# EAGLE design ECPR_EMITTER (EAGLE 9.4.2)
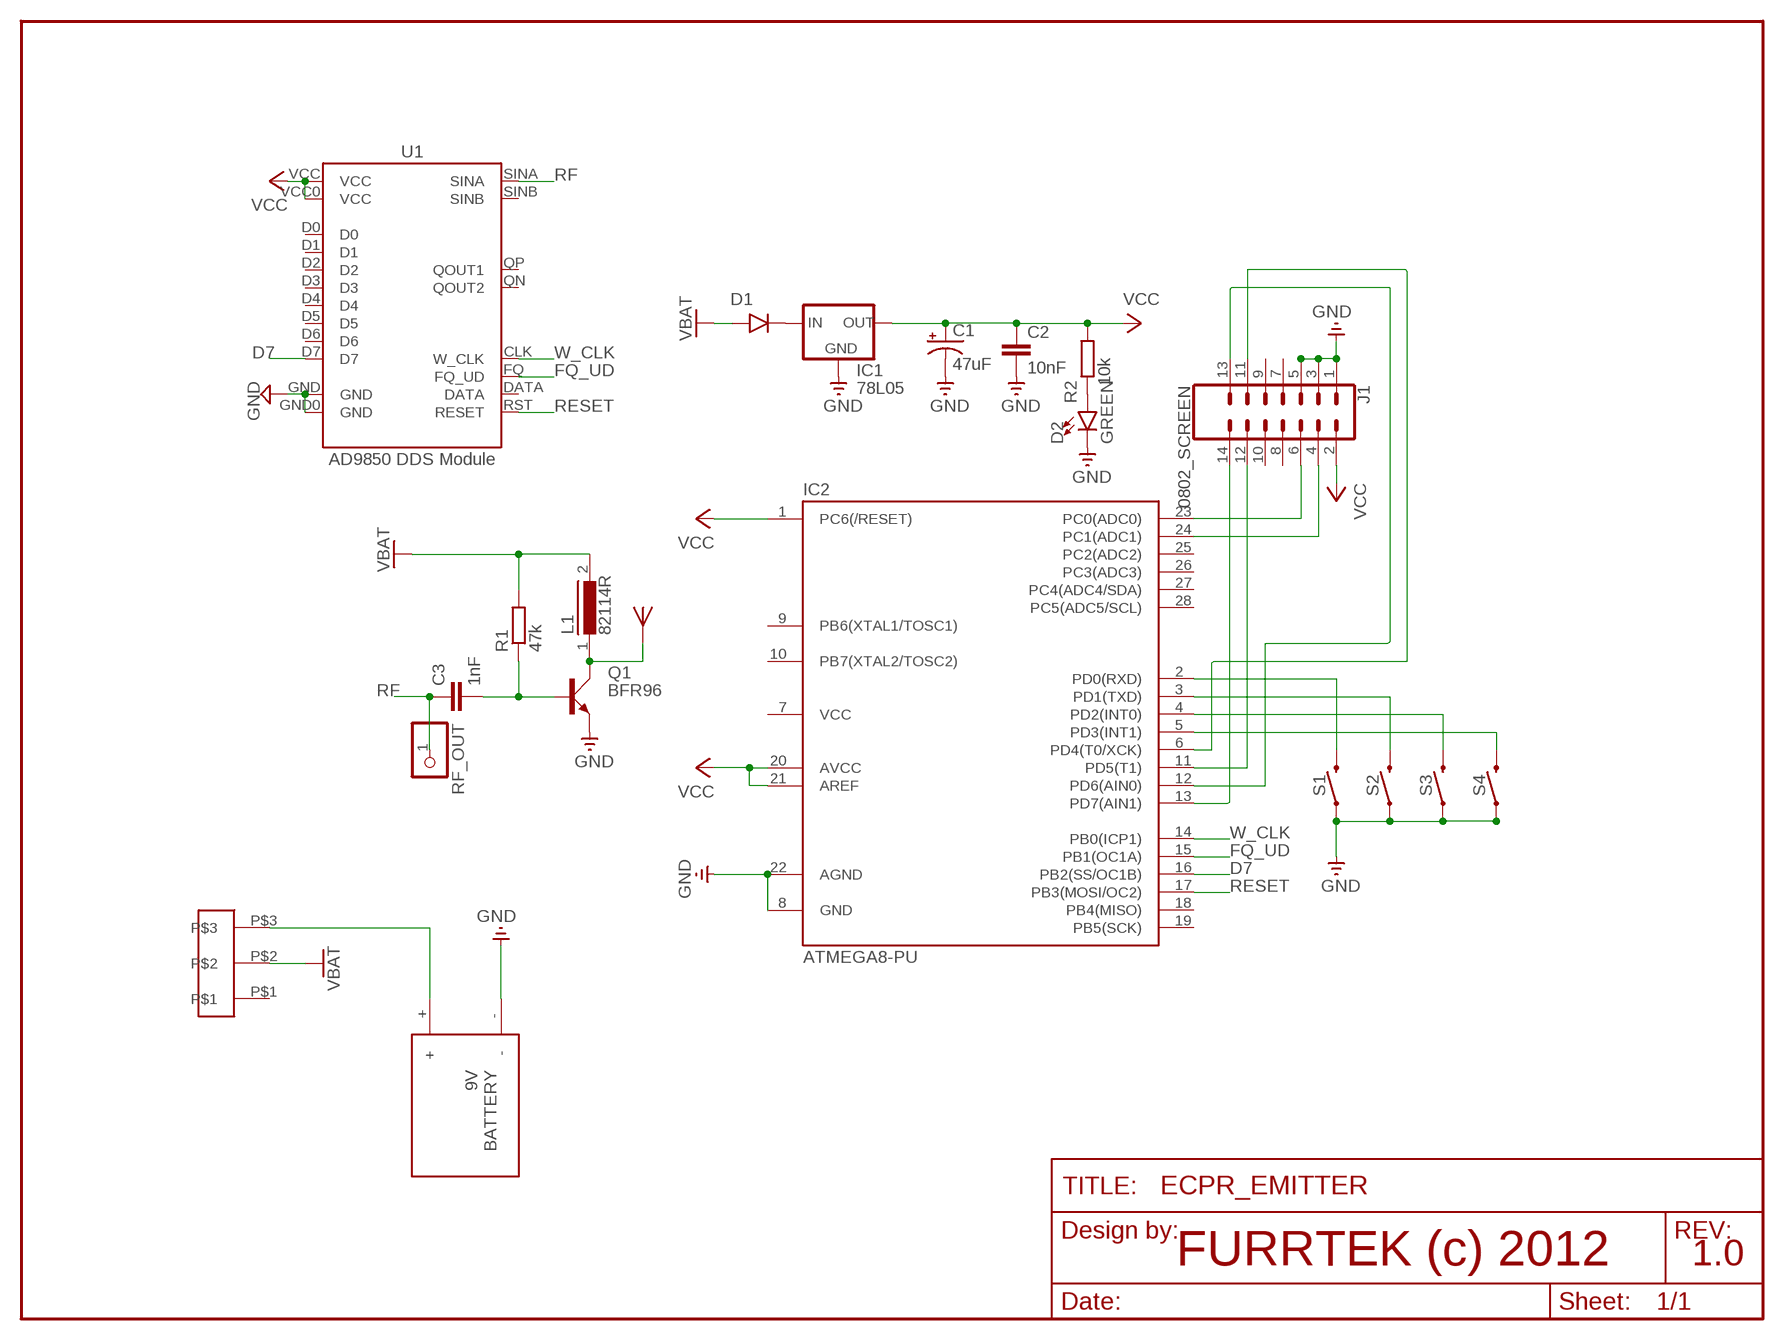
[diagram p0: schematic, sheet 1]

## Parts
C1  47uF  CAP_POLPTH2  [CPOL-RADIAL-10UF-25V]
C2  10nF  10NF-PTH-10MM-10000V-1-%  [CAP-PTH-10MM]
C3  1nF  C5/3  [C5B3]
D1  1N4001  [DO41-10]
D2  GREEN  LED-3MM-NO_SILK  [LED_3MM-NS]
FRAME1  FRAME-LETTERNO_PACKAGE  [DUMMY]
IC1  78L05  V_REG_78XXSIDE  [78XXL]
IC2  ATMEGA8-PU  [DIL28-3]
J1  0802_SCREEN  CONN_08X2  [2X8]
L1  82114R  [82114R]
Q1  BFR96  [SOT37]
R1  47k  R-EU_0207/7  [0207/7]
R2  10k  R-EU_0207/7  [0207/7]
RF_OUT  PINHD-1X1  [1X01]
S1  MOMENTARY-SWITCH-SPST-PTH-12MM  [TACTILE_SWITCH_PTH_12MM]
S2  MOMENTARY-SWITCH-SPST-PTH-12MM  [TACTILE_SWITCH_PTH_12MM]
S3  MOMENTARY-SWITCH-SPST-PTH-12MM  [TACTILE_SWITCH_PTH_12MM]
S4  MOMENTARY-SWITCH-SPST-PTH-12MM  [TACTILE_SWITCH_PTH_12MM]
U1  AD9850 DDS Module  DDS_MODULE:AD9850DDS_MODULE  [DDS_AD9850]
U$1  ANT.  ANTENNA  [ANTENNA]
U$2  PACKAGESWITCH  [SLIDESWITCH]
U$3  BAT  [BAT]

## Nets
D7: IC2.16(PB2(SS/OC1B)) U1.D7
FQ_UD: IC2.15(PB1(OC1A)) U1.FQ(FQ_UD)
GND: C1.2(-) C2.2 D2.K(C) IC1.GND IC2.8(GND) IC2.22(AGND) J1.1 J1.3 J1.5 Q1.2(E) S1.1 S2.1 S3.1 S4.1 U1.GND U1.GND0(GND) U$3.-
N$1: D1.C(CATHODE) IC1.IN
N$2: C3.2 Q1.3(B) R1.1
N$3: IC2.2(PD0(RXD)) S1.3
N$4: IC2.3(PD1(TXD)) S2.3
N$5: IC2.4(PD2(INT0)) S3.3
N$6: IC2.5(PD3(INT1)) S4.3
N$7: L1.1 Q1.1(C) U$1.ANT
N$8: IC2.24(PC1(ADC1)) J1.4
N$9: IC2.23(PC0(ADC0)) J1.6
N$10: IC2.13(PD7(AIN1)) J1.14
N$11: IC2.11(PD5(T1)) J1.12
N$12: U$2.P$3 U$3.+
N$13: IC2.12(PD6(AIN0)) J1.13
N$14: IC2.6(PD4(T0/XCK)) J1.11
N$16: D2.A R2.1
RESET: IC2.17(PB3(MOSI/OC2)) U1.RST(RESET)
RF: C3.1 RF_OUT.1 U1.SINA
VBAT: D1.A(ANODE) L1.2 R1.2 U$2.P$2
VCC: C1.1(+) C2.1 IC1.OUT IC2.1(PC6(/RESET)) IC2.20(AVCC) IC2.21(AREF) J1.2 R2.2 U1.VCC U1.VCC0(VCC)
W_CLK: IC2.14(PB0(ICP1)) U1.CLK(W_CLK)
Unconnected: IC2.9(PB6(XTAL1/TOSC1)) IC2.10(PB7(XTAL2/TOSC2)) IC2.18(PB4(MISO)) IC2.19(PB5(SCK)) IC2.25(PC2(ADC2)) IC2.26(PC3(ADC3)) IC2.27(PC4(ADC4/SDA)) IC2.28(PC5(ADC5/SCL)) J1.7 J1.8 J1.9 J1.10 U1.D0 U1.D1 U1.D2 U1.D3 U1.D4 U1.D5 U1.D6 U1.DATA U1.QN(QOUT2) U1.QP(QOUT1) U1.SINB U$2.P$1

## Notes on the sheet
- FURRTEK (c) 2012 | 1.0

## Power pins joined to a net without a drawn wire
VCC: IC2.7(VCC)

## Library data of the parts
C1 = SparkFun:CAP_POL: Capacitor Polarized These are standard SMD and PTH capacitors. Normally 10uF, 47uF, and 100uF in electrolytic and tantalum varieties. Always verify the external diameter of the through hole cap, it varies with capacity, voltage, and manufacturer. The EIA devices should be standard.
C2 = SparkFun-Capacitors:10NF: 0.01uF/10nF/10,000pF ceramic capacitors A capacitor is a passive two-terminal electrical component used to store electrical energy temporarily in an electric field. CAP-09321; PROD_ID: CAP-09321
C3 = capacitor-wima:C: CAPACITOR naming: grid - package width
D1 = tango:1N4001: DIODE general purpose rectifier, 1 A
D2 = SparkFun-LED:LED: LED (Generic) Standard schematic elements and footprints for 5mm, 3mm, 1206, and 0603 sized LEDs. Generic LEDs with no color specified.
FRAME1 = SparkFun-Aesthetics:FRAME-LETTER: Schematic Frame - Letter Standard 8.5x11 US Letter frame; DESIGNER: Nobody; VERSION: v01
IC1 = SparkFun:V_REG_78XX: Voltage Regulator Standard 7805 5V regulator. IGO (Input Ground Output). Spark Fun Electronics SKU : COM-00107
IC2 = atmega8:ATMEGA8-PU
J1 = SparkFun-Connectors:CONN_08X2: Multi connection point. Often used as Generic Header-pin footprint for 0.1 inch spaced/style header connections You can populate with any combo of single row headers, but if you'd like an exact match, check this: Header - 2x8 (Male, 0.1") <https://www.sparkfun.com/products/13156> (PRT-13156) On any of the 0.1 inch spaced packages, you can populate with these: Break Away Headers - Straight <https://www.sparkfun.com/products/116> (PRT-00116) Break Away Male Headers - Right Angle <https://www.sparkfun.com/products/553> (PRT-00553) Female Headers <https://www.sparkfun.com/products/115> (PRT-00115) Break Away Headers - Machine Pin <https://www.sparkfun.com/products/117> (PRT-00117) Break Away Female Headers - Swiss Machine Pin <https://www.sparkfun.com/products/743> (PRT-00743)
L1 = inductors:82114R: INDUCTOR
Q1 = transistor-small-signal:BFR96: NPN Silicon High-Frequency Transistor Source: http://www.ee.siue.edu/~alozows/library/datasheets/BFR96.pdf
R1 R2 = resistor:R-EU_: RESISTOR, European symbol
RF_OUT = adafruit:PINHD-1X1: Pin header 1x1 for 0.1" spacing With round pins
S1-S4 = SparkFun-Switches:MOMENTARY-SWITCH-SPST: Momentary Switch (Pushbutton) - SPST Normally-open (NO) SPST momentary switches (buttons, pushbuttons). Variants PTH-12MM - 12mm square, through-hole Momentary Pushbutton Switch - 12mm Square <https://www.sparkfun.com/products/9190> (COM-09190) PTH-6.0MM, PTH-6.0MM-KIT - 6.0mm square, through-hole Mini Pushbutton Switch <https://www.sparkfun.com/products/97> (COM-00097) KIT package intended for soldering kit's - only one side of pads' copper is exposed. PTH-RIGHT-ANGLE-KIT - Right-angle, through-hole Right Angle Tactile Button <https://www.sparkfun.com/products/10791> - Used on SparkFun BigTime Watch Kit <https://www.sparkfun.com/products/11734> SMD-12MM - 12mm square, surface-mount Tactile Button - SMD (12mm) <https://www.sparkfun.com/products/12993> (COM-12993) Used on SparkFun PicoBoard <https://www.sparkfun.com/products/11888> SMD-4.5MM - 4.5mm Square Trackball Switch Used on SparkFun Blackberry Trackballer Breakout <https://www.sparkfun.com/products/13169> SMD-4.6MMX2.8MM - 4.60mm x 2.80mm, surface mount Used on SparkFun SAMD21 Mini Breakout <https://www.sparkfun.com/products/13664> SMD-5.2MM, SMD-5.2-REDUNDANT - 5.2mm square, surface-mount Mini Pushbutton Switch - SMD <https://www.sparkfun.com/products/8720> (COM-08720) Used on Arduino Pro Mini <https://www.sparkfun.com/products/11114> REDUNDANT package connects both switch circuits together SMD-6.0X3.5MM - 6.0 x 3.5mm, surface mount Momentary Reset Switch SMD <https://www.sparkfun.com/products/8229> (COM-08229) SMD-6.2MM-TALL - 6.2mm square, surface mount Tactile Button - SMD (6mm) <https://www.sparkfun.com/products/12992> Used on SparkFun Digital Sandbox <https://www.sparkfun.com/products/12651> SMD-RIGHT-ANGLE - Right-angle, surface mount Used on SparkFun Block for Intel® Edison - Arduino <https://www.sparkfun.com/products/13036>; PROD_ID: SWCH-09185; SF_SKU: COM-09190
U1 = dds-module-ad9850:DDS_MODULE:AD9850: AD9850 DDS Module Created by Johan Adler, October 2014. Not tested on an actual PCB, so I can't promise anything. Also please check the actual pinout of your specific module. Mine are of the low price eBay version, and the pinout is correct for my modules. The placement of VCC over data pins over GND on the symbol is meant to make it easier to set it up for default serial transfer. For this you would connect D0 and D1 to VCC, D2 to GND. IOUT is analog signal out, sinus wave, QOUT is square wave. Outputs 1 are normal, outputs 2 are inverted.
U$1 = computronics.com.au:ANTENNA: Antenna - single wire
U$2 = SLIDESWITCH:PACKAGESWITCH
U$3 = BATTERY:BAT: 2000mAh battery

## Board
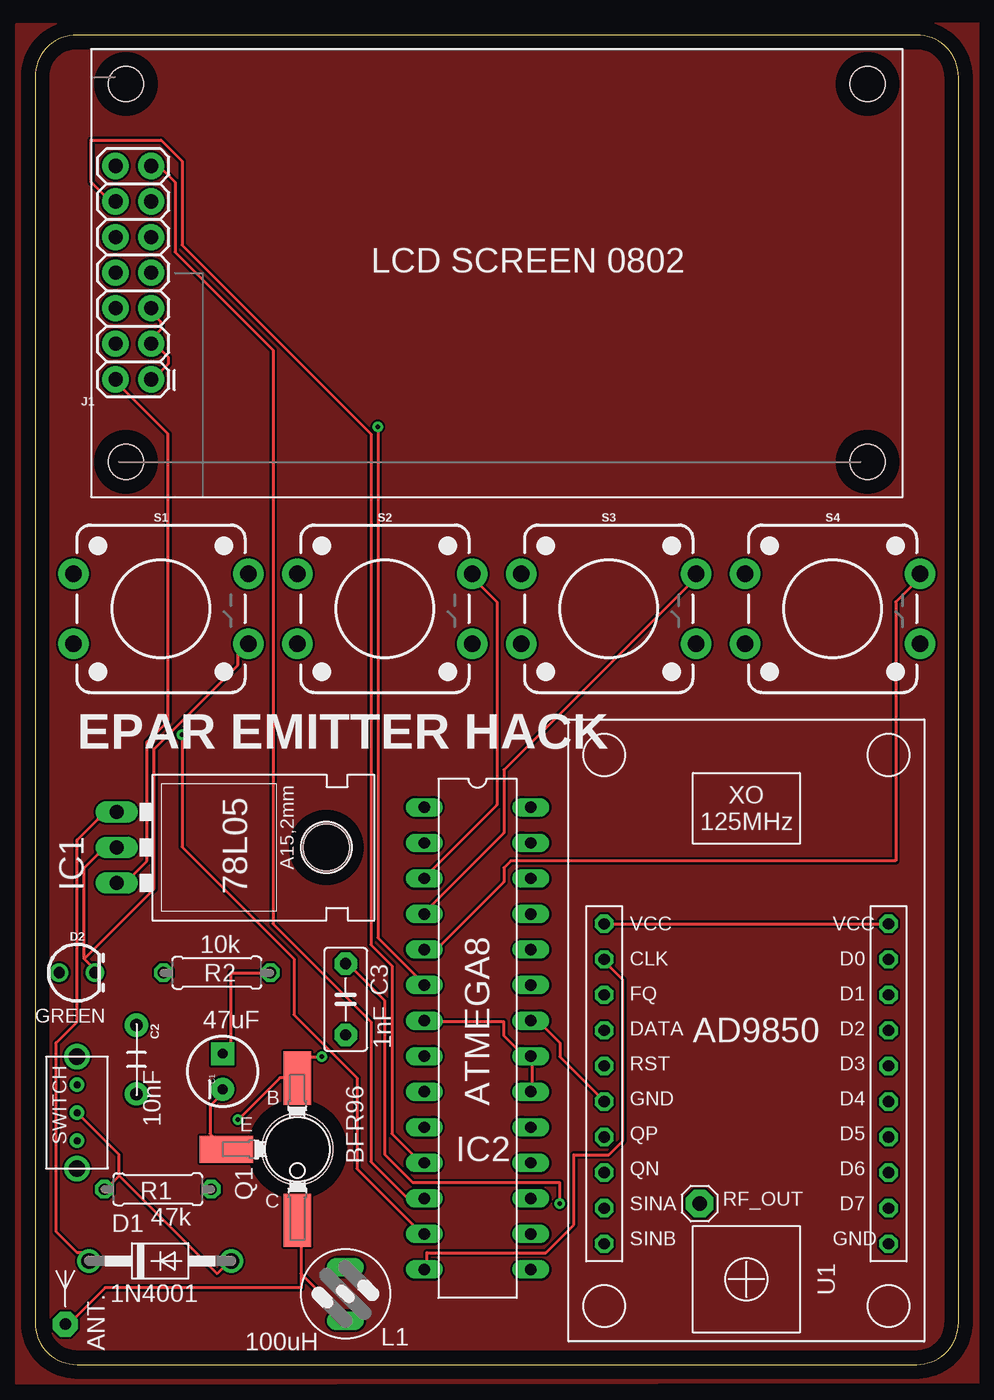
[diagram p1: board, top side]
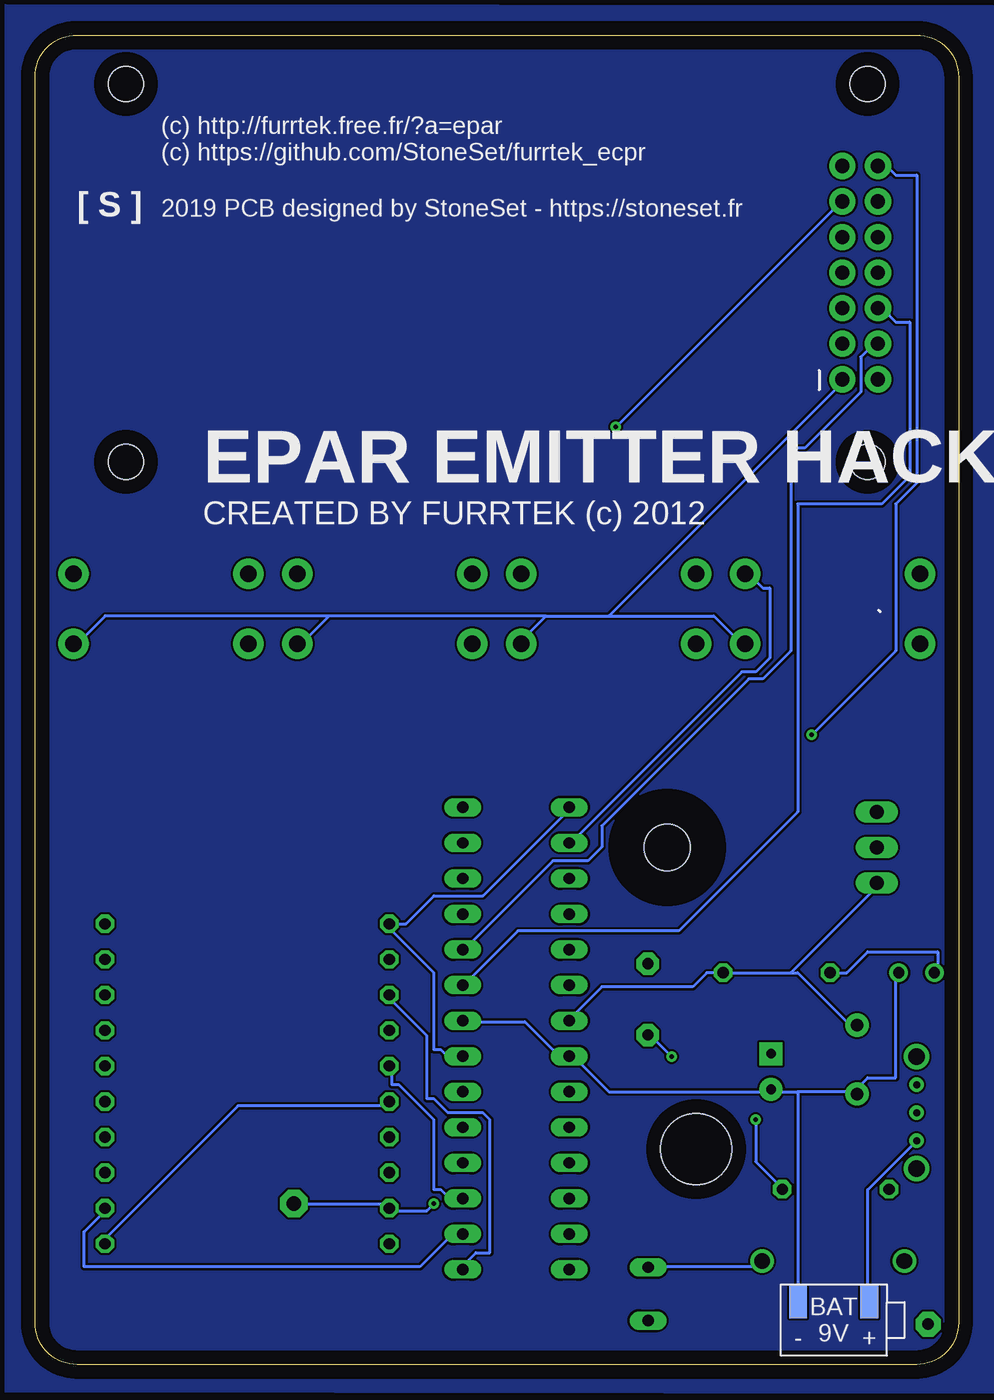
[diagram p2: board, bottom side, seen from below]

Size 66 x 95 mm. Coordinates in mm from the lower left corner, seen from the top.
Outline: 0,92 0,3 arc90 3,0 63,0 arc90 66,3 66,92 arc90 63,95 3,95 arc90 0,92
Copper layers (1*16): Top 0.035mm / dielectric 1.5mm / Bottom 0.035mm
Design rules "default *": minimum track width 9mil, minimum drill 0.35mm, track to track 6mil, track to pad 6mil, pad to pad 6mil, via to via 6mil, smd to smd 6mil, copper to edge 40mil, drill to drill 6mil, minimum pad ring 10mil, minimum via ring 8mil, stop-mask expansion 4mil, vias tented up to drill 0mil, thermal gap 10mil
Holes 2.5 mm at 59.5,91.5 59.5,64.5 6.5,64.5 6.5,91.5

### Footprints (pad centres in the part's own frame; a part is rotated, then mirrored left to right if it is on the bottom)
CPOL-RADIAL-10UF-25V = drill 0.7 pad 1.651 square: 1 1.27,0 | drill 0.7 pad 1.651: 2 -1.27,0
CAP-PTH-10MM = drill 0.9 pad 1.651: 1 -2.46,0; 2 2.46,0
C5B3 = drill 0.813 pad 1.6 octagon: 1 -2.54,0; 2 2.54,0
DO41-10 = drill 1.118: A 5.08,0; C -5.08,0
LED_3MM-NS = drill 0.813: A -1.27,0; K 1.27,0
78XXL = drill 1.016 long: GND 0,-3.81; IN -2.54,-3.81; OUT 2.54,-3.81 | hole 3.302: 0,11.176
DIL28-3 = drill 0.813 long: 1 -16.51,-3.81; 2 -13.97,-3.81; 3 -11.43,-3.81; 4 -8.89,-3.81; 5 -6.35,-3.81; 6 -3.81,-3.81; 7 -1.27,-3.81; 8 1.27,-3.81; 9 3.81,-3.81; 10 6.35,-3.81; 11 8.89,-3.81; 12 11.43,-3.81; 13 13.97,-3.81; 14 16.51,-3.81; 15 16.51,3.81; 16 13.97,3.81; 17 11.43,3.81; 18 8.89,3.81; 19 6.35,3.81; 20 3.81,3.81; 21 1.27,3.81; 22 -1.27,3.81; 23 -3.81,3.81; 24 -6.35,3.81; 25 -8.89,3.81; 26 -11.43,3.81; 27 -13.97,3.81; 28 -16.51,3.81
2X8 = drill 1.016 pad 1.88: 1 0,0; 2 0,2.54; 3 2.54,0; 4 2.54,2.54; 5 5.08,0; 6 5.08,2.54; 7 7.62,0; 8 7.62,2.54; 9 10.16,0; 10 10.16,2.54; 11 12.7,0; 12 12.7,2.54; 13 15.24,0; 14 15.24,2.54
82114R = drill 0.813 long: 1 0,1.905; 2 0,-1.905
SOT37 = smd 1.93 x 3.81: 1 0,5.08; 3 0,-5.08 | smd 3.81 x 1.93: 2 5.08,0 | hole 5.08: 0,0
0207/7 = drill 0.813 octagon: 1 -3.81,0; 2 3.81,0
1X01 = drill 1.016 pad 1.93 octagon: 1 0,0
TACTILE_SWITCH_PTH_12MM = drill 1.2 pad 2.159: 1 6.25,-2.5; 2 -6.25,-2.5; 3 6.25,2.5; 4 -6.25,2.5
DDS_AD9850 = drill 0.8 octagon: CLK 5.08,10.16; D0 5.08,-10.16; D1 2.54,-10.16; D2 0,-10.16; D3 -2.54,-10.16; D4 -5.08,-10.16; D5 -7.62,-10.16; D6 -10.16,-10.16; D7 -12.7,-10.16; DATA 0,10.16; FQ 2.54,10.16; GND -5.08,10.16; GND0 -15.24,-10.16; QN -10.16,10.16; QP -7.62,10.16; RST -2.54,10.16; SINA -12.7,10.16; SINB -15.24,10.16; VCC 7.62,10.16; VCC0 7.62,-10.16
ANTENNA = drill 0.813 pad 1.778 octagon: ANT 0,0
SLIDESWITCH = drill 0.5: P$1 0,0; P$2 0,-2; P$3 0,-4 | drill 1.2: P$4 0,2; P$5 0,-6
BAT = smd 1.27 x 2.337: + 7.62,-2.54; - 2.54,-2.54

### Placement (x,y rotation side)
C1  13.4,20.94 90 top
C2  7.25,21.79 270 top
C3  22.2,26.09 270 top
D1  8.95,7.4 0 top
D2  3,28 0 top
FRAME1  0,0 0 top
IC1  9.65,36.95 270 top
IC2  31.62,23.3 270 top
J1  8.3,70.4 90 top
L1  22.18,5.04 180 top
Q1  18.75,15.38 180 top
R1  8.78,12.52 180 top
R2  13,28 0 top
RF_OUT  47.5,11.5 0 top
S1  9,54 0 top
S2  25,54 0 top
S3  41,54 0 top
S4  57,54 0 top
U1  50.84,23.87 90 top
U$1  2.17,2.88 0 top
U$2  3,20 0 top
U$3  14,7 0 bottom

### Tracks (layer width: path | path; a pad name or v marks a point on that pad's centre or on a via)
BOT
  pour Bottom: -2.46,-2.05 68.1,-1.96 68.1,97.16 -2.46,97.07
D7
  Bottom 0.229: U1.D7 61,11 62.5,9.5 62.5,7 38.5,7 36.5,9 35.5,9 IC2.16
FQ_UD
  Bottom 0.229: U1.FQ 40.5,26 38,23.5 38,19 37.5,19 36.5,18 34,18 33.5,17.5 33.5,8 34.5,8 35.5,7 IC2.15
GND
  Top 0.229: 8.5,73 9.5,72 9.5,71.5 8.5,70.5 J1.1 | 8.5,73 8.5,73.5 9,74 9,74.5 8.5,75 J1.5 | 8.5,73 J1.3 | Q1.2 13.5,15.5 12.5,16.5 12.5,18.5 13,19 13.5,19 13.5,19.5 C1.2 | 3.5,29 3.5,35.5 4.5,36.5 5.5,36.5 IC1.GND | 3.5,29 4,28.5 4,28 D2.K | U1.GND 40.5,19 37.5,22 37.5,23 35.5,25 IC2.22 | 3.5,29 8.5,34 8.5,44 14.5,50 14.5,51 15,51.5 S1.1
  Bottom 0.229: 29.5,53.5 25,53.5 | 25,53.5 17.5,53.5 15.5,51.5 S1.1 | 29.5,53.5 31.5,51.5 S2.1 | 45,53.5 47,51.5 S3.1 | 29.5,53.5 45,53.5 | 45,53.5 61,53.5 63,51.5 S4.1 | 25,53.5 8.5,70 J1.1 | 11.5,19.5 11.5,4.5 U$3.- | 11.5,19.5 13,19.5 C1.2 13.5,19.5 25,19.5 27.5,22 IC2.8 28,22.5 29,22.5 31,24.5 35,24.5 IC2.22 | 7.5,19.5 6.5,20.5 4.5,20.5 4.5,28 D2.K | 7.5,19.5 11.5,19.5 | 7.5,19.5 C2.2 | U1.GND0 61,9 51.5,18.5 41,18.5 U1.GND
N$1
  Top 0.229: IC1.IN 5.5,39 4.5,39 3,37.5 3,24.5 1.5,23 1.5,9.5 3,8 3.5,8 3.5,7.5 D1.C
N$2  (via drill 0.35)
  Top 0.229: v14.5,17.5 17.5,20.5 18.5,20.5 Q1.3 19,20.5 19,22 v20.5,22
  Bottom 0.229: v14.5,17.5 14.5,14.5 13,13 R1.1 | v20.5,22 22,23.5 C3.2
N$3
  Bottom 0.229: IC2.2 27.5,37.5 15.5,49.5 14.5,49.5 13.5,50.5 13.5,55.5 14,55.5 15,56.5 S1.3
N$4
  Top 0.229: IC2.3 28,35 33,40 33,54.5 31.5,56 31.5,56.5 S2.3
N$5
  Top 0.229: IC2.4 28,32.5 33.5,38 33.5,42.5 47,56 47,56.5 S3.3
N$6
  Top 0.229: IC2.5 28,30 29,30 33.5,34.5 33.5,35.5 34,36 61.5,36 61.5,54.5 63,56 63,56.5 S4.3
N$7
  Top 0.229: 19,6.5 22,3.5 L1.1 | 19,6.5 19,10 Q1.1 | 19,6.5 19,5.5 5,5.5 2.5,3 U$1.ANT
N$8
  Bottom 0.229: IC2.24 35,30 29,36 26.5,36 25.5,37 25.5,38.5 15,49 14,49 12,51 12,65.5 11,65.5 7,69.5 7,72 6.5,72.5 6.5,73 6,73 J1.4
N$9
  Bottom 0.229: IC2.23 35,27.5 31.5,31 20,31 11.5,39.5 11.5,61.5 5.5,61.5 3.5,63.5 3.5,74.5 4.5,74.5 5,75 5,75.5 5.5,75.5 J1.6
N$10  (via drill 0.35)
  Top 0.229: v10.5,45 10.5,37 18.5,29 18.5,25 23,20.5 23,14 27.5,9.5 IC2.13
  Bottom 0.229: v10.5,45 4.5,51 4.5,61.5 3,63 3,85 4.5,85 5,85.5 5.5,85.5 J1.14
N$11
  Top 0.229: IC2.11 27.5,14.5 25.5,16.5 25.5,28.5 24,30 24,66.5 10.5,80 10.5,86 9,87.5 4,87.5 4,84.5 5.5,83 J1.12
N$12
  Bottom 0.229: U$2.P$3 6.5,12.5 6.5,4.5 U$3.+
N$13
  Top 0.229: IC2.12 27.5,12 26.5,12 24,14.5 24,24.5 17,31.5 17,72.5 10,79.5 10,84.5 8.5,86 J1.13
N$14  (via drill 0.35)
  Top 0.229: v24.5,67 24.5,30.5 27.5,27.5 IC2.6
  Bottom 0.229: v24.5,67 9,82.5 9,83 8.5,83 J1.11
N$16
  Bottom 0.229: R2.1 8,28 6.5,29.5 1.5,29.5 1.5,28 D2.A
RESET
  Bottom 0.229: U1.RST 40.5,21 40.5,20 40,20 37.5,17.5 37.5,12.5 37,12.5 36.5,12 35.5,12 IC2.17
RF  (via drill 0.35)
  Top 0.229: v37.5,11.5 37.5,13 27,13 25,15 25,26 22.5,28.5 C3.1
  Bottom 0.229: RF_OUT.1 41,11.5 U1.SINA 40.5,11 38,11 v37.5,11.5
TOP
  pour Top: -1.36,-1.37 67.45,-1.28 67.45,95.85 -1.36,95.77
VBAT
  Top 0.229: U$2.P$2 6,15 6,13.5 | 6,13.5 5,12.5 R1.2 | 6,13.5 13,6.5 14,7.5 D1.A
  Bottom 0.229: L1.2 22,7 14.5,7 D1.A
VCC
  Top 0.229: U1.VCC0 41,31.5 U1.VCC | IC2.7 28,24.5 33.5,24.5 33.5,23.5 35,22 IC2.21 35.5,22 35.5,19.5 IC2.20 | R2.2 14,28 14,22.5 13.5,22 C1.1 | J1.2 6,70 9.5,66.5 9.5,46 8,44.5 8,36 6,34 IC1.OUT
  Bottom 0.229: IC2.21 35.5,22 36.5,22 37,22.5 37.5,22.5 37.5,28 40.5,31 U1.VCC 40.5,31.5 39.5,31.5 37.5,33.5 34,33.5 28,39.5 IC2.1 | 12,28 6,34 IC1.OUT | 12,28 R2.2 18,28 19,27 25.5,27 27.5,25 IC2.7 | 12,28 11.5,28 8,24.5 7.5,24.5 C2.1
W_CLK
  Top 0.229: U1.CLK 41,28.5 42,27.5 42,16 41,15 38.5,15 38.5,10 36.5,8 28,8 28,7 IC2.14

### Text on the board
tPlace: LCD SCREEN 0802 | EPAR EMITTER HACK | 78L05 | VCC | VCC | 10k | CLK | D0 | FQ | D1 | GREEN | 47uF | DATA | D2 | 1nF | AD9850 | RST | D3 | ATMEGA8 | GND | D4 | 10nF | SWITCH | QP | D5 | BFR96 | QN | D6 | SINA | D7 | 47k | SINB | GND | 1N4001 | ANT. | 100uH
bPlace: (c) http://furrtek.free.fr/?a=epar / (c) https://github.com/StoneSet/furrtek_ecpr | 2019 PCB designed by StoneSet - https://stoneset.fr | [ S ] | EPAR EMITTER HACK | CREATED BY FURRTEK (c) 2012